# EAGLE design PowerSupply_12V_v1 (EAGLE 9.6.2)

## Sheet 1 of 3: MAIN
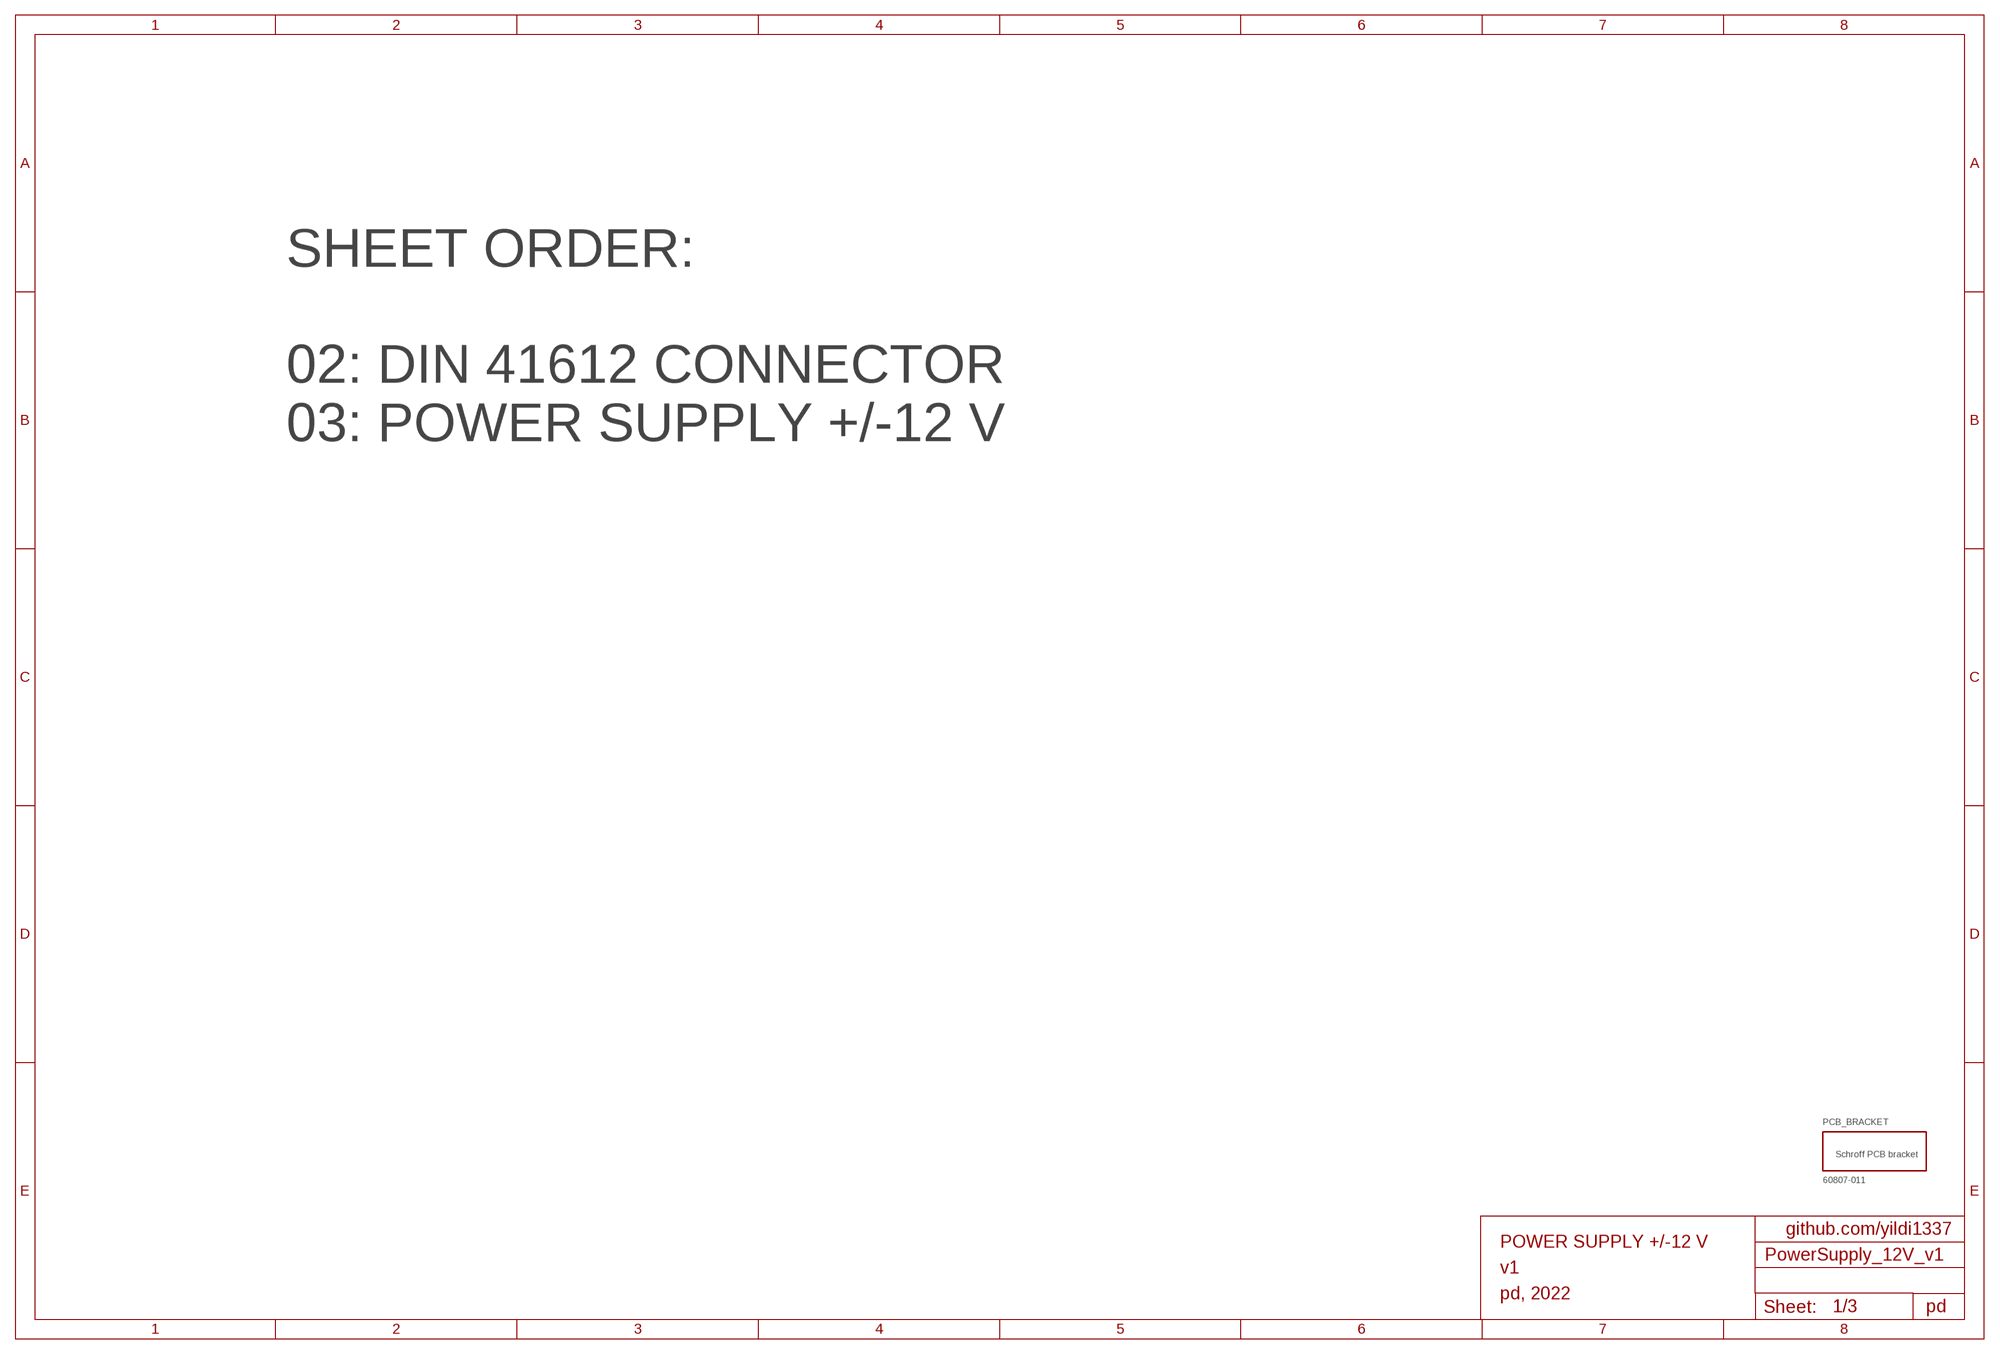
[diagram p0: schematic, sheet 1]

### Parts
PCB_BRACKET  60807-011  [60807-011]

### Notes on the sheet
- SHEET ORDER:
  
  02: DIN 41612 CONNECTOR
  03: POWER SUPPLY +/-12 V
- github.com/yildi1337
- POWER SUPPLY +/-12 V
- v1
- pd, 2022
- pd

## Sheet 2 of 3: DIN 41612 CONNECTOR
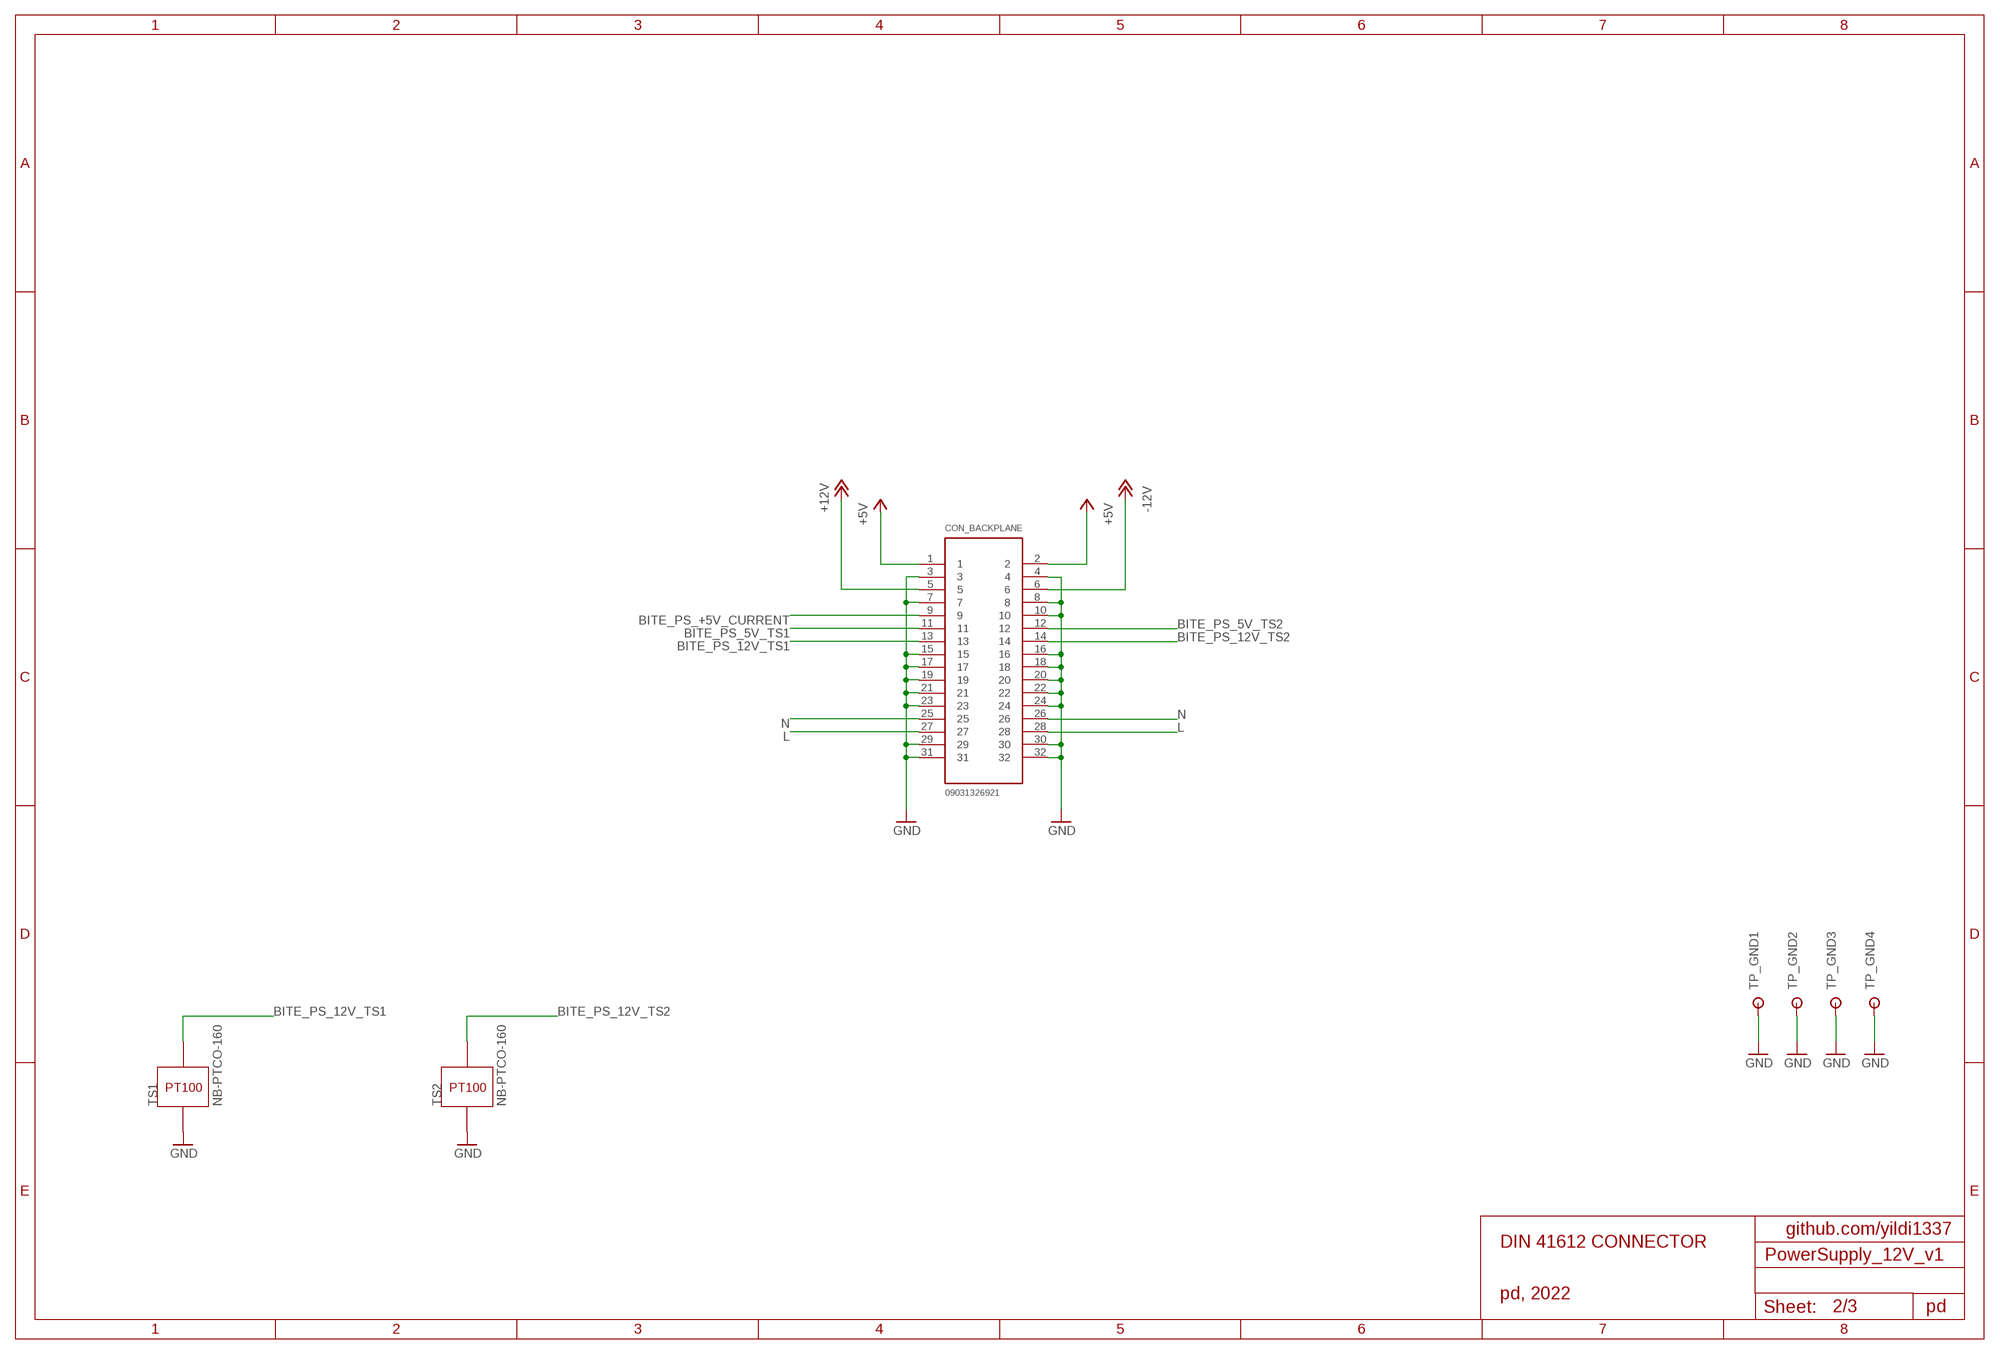
[diagram p1: schematic, sheet 2]

### Parts
CON_BACKPLANE  09031326921  [09031326921]
TP_GND1  RSPRO-1MM-TERMINAL-POST-2622034  [RSPRO-1MM-TERMINAL-POST-2622034]
TP_GND2  RSPRO-1MM-TERMINAL-POST-2622034  [RSPRO-1MM-TERMINAL-POST-2622034]
TP_GND3  RSPRO-1MM-TERMINAL-POST-2622034  [RSPRO-1MM-TERMINAL-POST-2622034]
TP_GND4  RSPRO-1MM-TERMINAL-POST-2622034  [RSPRO-1MM-TERMINAL-POST-2622034]
TS1  NB-PTCO-160  [NB-PTCO-160]
TS2  NB-PTCO-160  [NB-PTCO-160]

### Nets
+5V: CON_BACKPLANE.1 CON_BACKPLANE.2
+12V: CON_BACKPLANE.5 ; also sheet 3
-12V: CON_BACKPLANE.6 ; also sheet 3
BITE_PS_5V_TS1: CON_BACKPLANE.11
BITE_PS_5V_TS2: CON_BACKPLANE.12
BITE_PS_12V_TS1: CON_BACKPLANE.13 TS1.1
BITE_PS_12V_TS2: CON_BACKPLANE.14 TS2.1
BITE_PS_+5V_CURRENT: CON_BACKPLANE.9
GND: CON_BACKPLANE.3 CON_BACKPLANE.4 CON_BACKPLANE.7 CON_BACKPLANE.8 CON_BACKPLANE.10 CON_BACKPLANE.15 CON_BACKPLANE.16 CON_BACKPLANE.17 CON_BACKPLANE.18 CON_BACKPLANE.19 CON_BACKPLANE.20 CON_BACKPLANE.21 CON_BACKPLANE.22 CON_BACKPLANE.23 CON_BACKPLANE.24 CON_BACKPLANE.29 CON_BACKPLANE.30 CON_BACKPLANE.31 CON_BACKPLANE.32 TP_GND1.P$1 TP_GND2.P$1 TP_GND3.P$1 TP_GND4.P$1 TS1.2 TS2.2 ; also sheet 3
L: CON_BACKPLANE.27 CON_BACKPLANE.28 ; also sheet 3
N: CON_BACKPLANE.25 CON_BACKPLANE.26 ; also sheet 3

### Notes on the sheet
- github.com/yildi1337
- DIN 41612 CONNECTOR
- pd, 2022
- pd

## Sheet 3 of 3: POWER SUPPLY +/-12 V
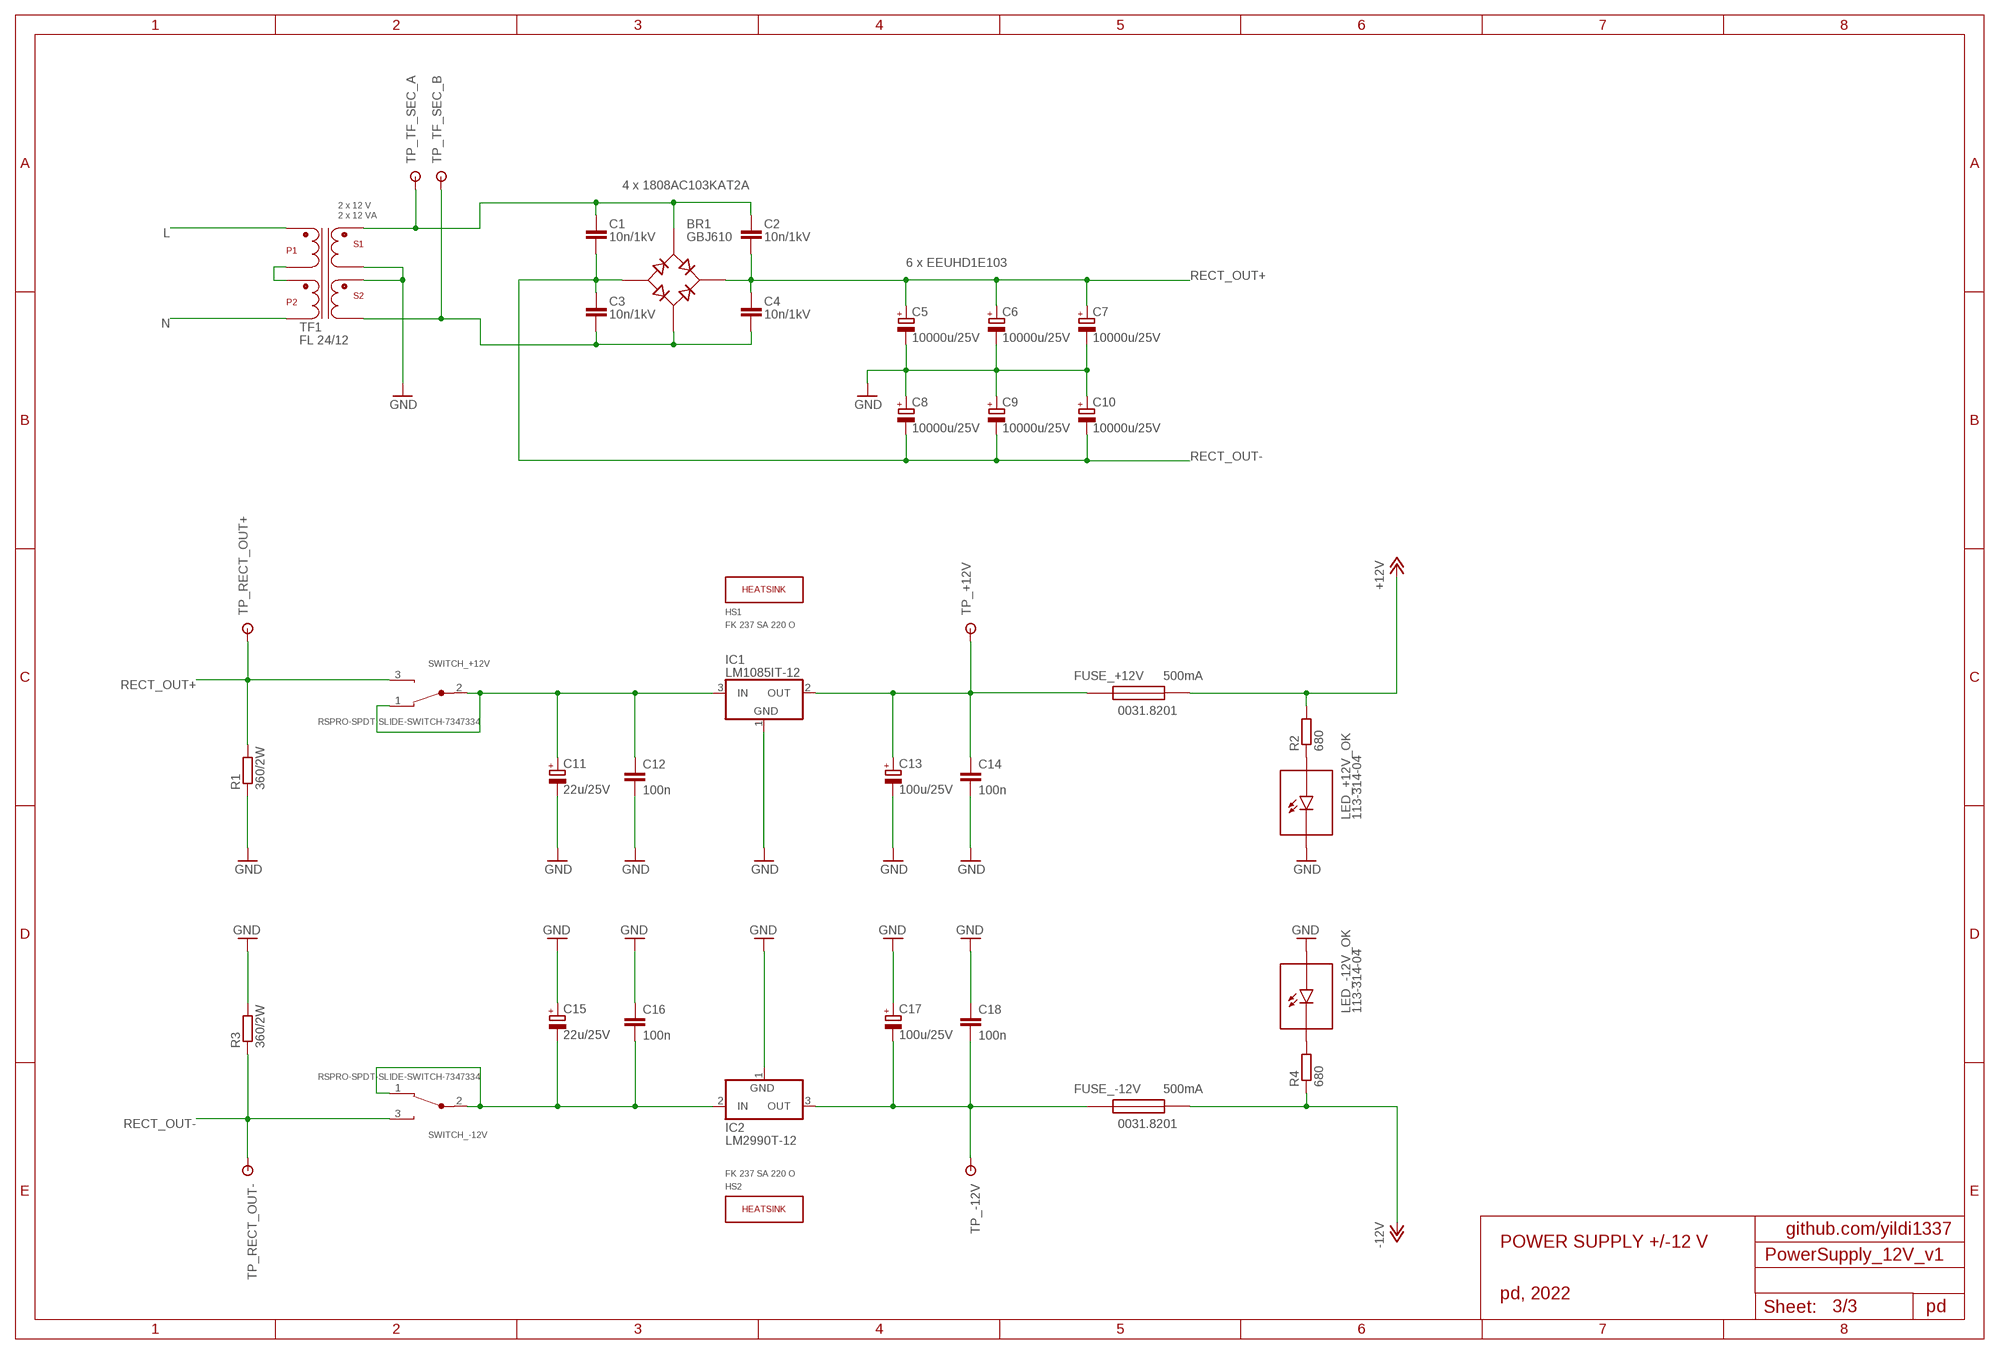
[diagram p2: schematic, sheet 3]

### Parts
BR1  GBJ610  [GBJ610]
C1  10n/1kV  C-EUC1808  [C1808]
C2  10n/1kV  C-EUC1808  [C1808]
C3  10n/1kV  C-EUC1808  [C1808]
C4  10n/1kV  C-EUC1808  [C1808]
C5  10000u/25V  EEUHD1E103  [EEUHD1E103]
C6  10000u/25V  EEUHD1E103  [EEUHD1E103]
C7  10000u/25V  EEUHD1E103  [EEUHD1E103]
C8  10000u/25V  EEUHD1E103  [EEUHD1E103]
C9  10000u/25V  EEUHD1E103  [EEUHD1E103]
C10  10000u/25V  EEUHD1E103  [EEUHD1E103]
C11  22u/25V  CPOL-EU153CLV-0505  [153CLV-0505]
C12  100n  C-EUC0603  [C0603]
C13  100u/25V  CPOL-EU153CLV-0810  [153CLV-0810]
C14  100n  C-EUC0603  [C0603]
C15  22u/25V  CPOL-EU153CLV-0505  [153CLV-0505]
C16  100n  C-EUC0603  [C0603]
C17  100u/25V  CPOL-EU153CLV-0810  [153CLV-0810]
C18  100n  C-EUC0603  [C0603]
FUSE_+12V  0031.8201  [0031.8201]
FUSE_-12V  0031.8201  [0031.8201]
HS1  FK 237 SA 220 O  FK_237_SA_220_O  [FK_237_SA_220_O]
HS2  FK 237 SA 220 O  FK_237_SA_220_O  [FK_237_SA_220_O]
IC1  LM1085IT-12  [LM1085IT-12]
IC2  LM2990T-12  [LM2990T-12]
LED_+12V_OK  113-314-04  [113-314-04]
LED_-12V_OK  113-314-04  [113-314-04]
R1  360/2W  R-EU_R2010  [R2010]
R2  680  R-EU_R0603  [R0603]
R3  360/2W  R-EU_R2010  [R2010]
R4  680  R-EU_R0603  [R0603]
SWITCH_+12V  RSPRO-SPDT-SLIDE-SWITCH-7347334  [RSPRO-SPDT-SLIDE-SWITCH-7347334]
SWITCH_-12V  RSPRO-SPDT-SLIDE-SWITCH-7347334  [RSPRO-SPDT-SLIDE-SWITCH-7347334]
TF1  FL 24/12  FL_24-12  [FL_24-12]
TP_+12V  RSPRO-1MM-TERMINAL-POST-2622034  [RSPRO-1MM-TERMINAL-POST-2622034]
TP_-12V  RSPRO-1MM-TERMINAL-POST-2622034  [RSPRO-1MM-TERMINAL-POST-2622034]
TP_RECT_OUT+  RSPRO-1MM-TERMINAL-POST-2622034  [RSPRO-1MM-TERMINAL-POST-2622034]
TP_RECT_OUT-  RSPRO-1MM-TERMINAL-POST-2622034  [RSPRO-1MM-TERMINAL-POST-2622034]
TP_TF_SEC_A  RSPRO-1MM-TERMINAL-POST-2622034  [RSPRO-1MM-TERMINAL-POST-2622034]
TP_TF_SEC_B  RSPRO-1MM-TERMINAL-POST-2622034  [RSPRO-1MM-TERMINAL-POST-2622034]

### Nets
+12V: FUSE_+12V.2 R2.2 ; also sheet 2
-12V: FUSE_-12V.2 R4.1 ; also sheet 2
GND: C5.- C6.- C7.- C8.+ C9.+ C10.+ C11.- C12.2 C13.- C14.2 C15.+ C16.1 C17.+ C18.1 IC1.1(GND) IC2.1(GND) LED_+12V_OK.-(C) LED_-12V_OK.+(A) R1.1 R3.2 TF1.S1B TF1.S2A ; also sheet 2
L: TF1.P1A ; also sheet 2
N: TF1.P2B ; also sheet 2
N$1: C15.- C16.2 IC2.2(IN) SWITCH_-12V.1(NC) SWITCH_-12V.2(COM)
N$2: LED_-12V_OK.-(C) R4.2
N$3: C17.- C18.2 FUSE_-12V.1 IC2.3(OUT) TP_-12V.P$1
N$5: TF1.P1B TF1.P2A
N$6: BR1.L C1.1 C2.1 TF1.S1A TP_TF_SEC_A.P$1
N$7: LED_+12V_OK.+(A) R2.1
N$8: C13.+ C14.1 FUSE_+12V.1 IC1.2(OUT) TP_+12V.P$1
N$10: BR1.N C3.2 C4.2 TF1.S2B TP_TF_SEC_B.P$1
N$12: C11.+ C12.1 IC1.3(IN) SWITCH_+12V.1(NC) SWITCH_+12V.2(COM)
RECT_OUT+: BR1.+ C2.2 C4.1 C5.+ C6.+ C7.+ R1.2 SWITCH_+12V.3(NO) TP_RECT_OUT+.P$1
RECT_OUT-: BR1.- C1.2 C3.1 C8.- C9.- C10.- R3.1 SWITCH_-12V.3(NO) TP_RECT_OUT-.P$1

### Notes on the sheet
- 4 x 1808AC103KAT2A
- 6 x EEUHD1E103
- 500mA
- 500mA
- github.com/yildi1337
- POWER SUPPLY +/-12 V
- pd, 2022
- pd

## Library data of the parts
BR1 = GBJ610:GBJ610
C1-C4 C12 C14 C16 C18 = rcl:C-EU: CAPACITOR, European symbol; SPICEPREFIX: C
C5-C10 = EEUHD1E103:EEUHD1E103
C11 C13 C15 C17 = rcl:CPOL-EU: POLARIZED CAPACITOR, European symbol; SPICEPREFIX: C
CON_BACKPLANE = 09031326921:09031326921
FUSE_+12V FUSE_-12V = 0031.8201:0031.8201
HS1 HS2 = FK_237_SA_220_O:FK_237_SA_220_O
IC1 = LM1085IT-12:LM1085IT-12
IC2 = LM2990T-12:LM2990T-12
LED_+12V_OK LED_-12V_OK = 113-314-04:113-314-04
PCB_BRACKET = 60807-011:60807-011
R1-R4 = rcl:R-EU_: RESISTOR, European symbol; SPICEPREFIX: R
SWITCH_+12V SWITCH_-12V = RSPRO-SPDT-SLIDE-SWITCH-7347334:RSPRO-SPDT-SLIDE-SWITCH-7347334
TF1 = FL_24-12:FL_24-12
TP_+12V TP_-12V TP_GND1-TP_GND4 TP_RECT_OUT+ TP_RECT_OUT- TP_TF_SEC_A TP_TF_SEC_B = RSPRO-1MM-TERMINAL-POST-2622034:RSPRO-1MM-TERMINAL-POST-2622034
TS1 TS2 = NB-PTCO-160:NB-PTCO-160

## Board
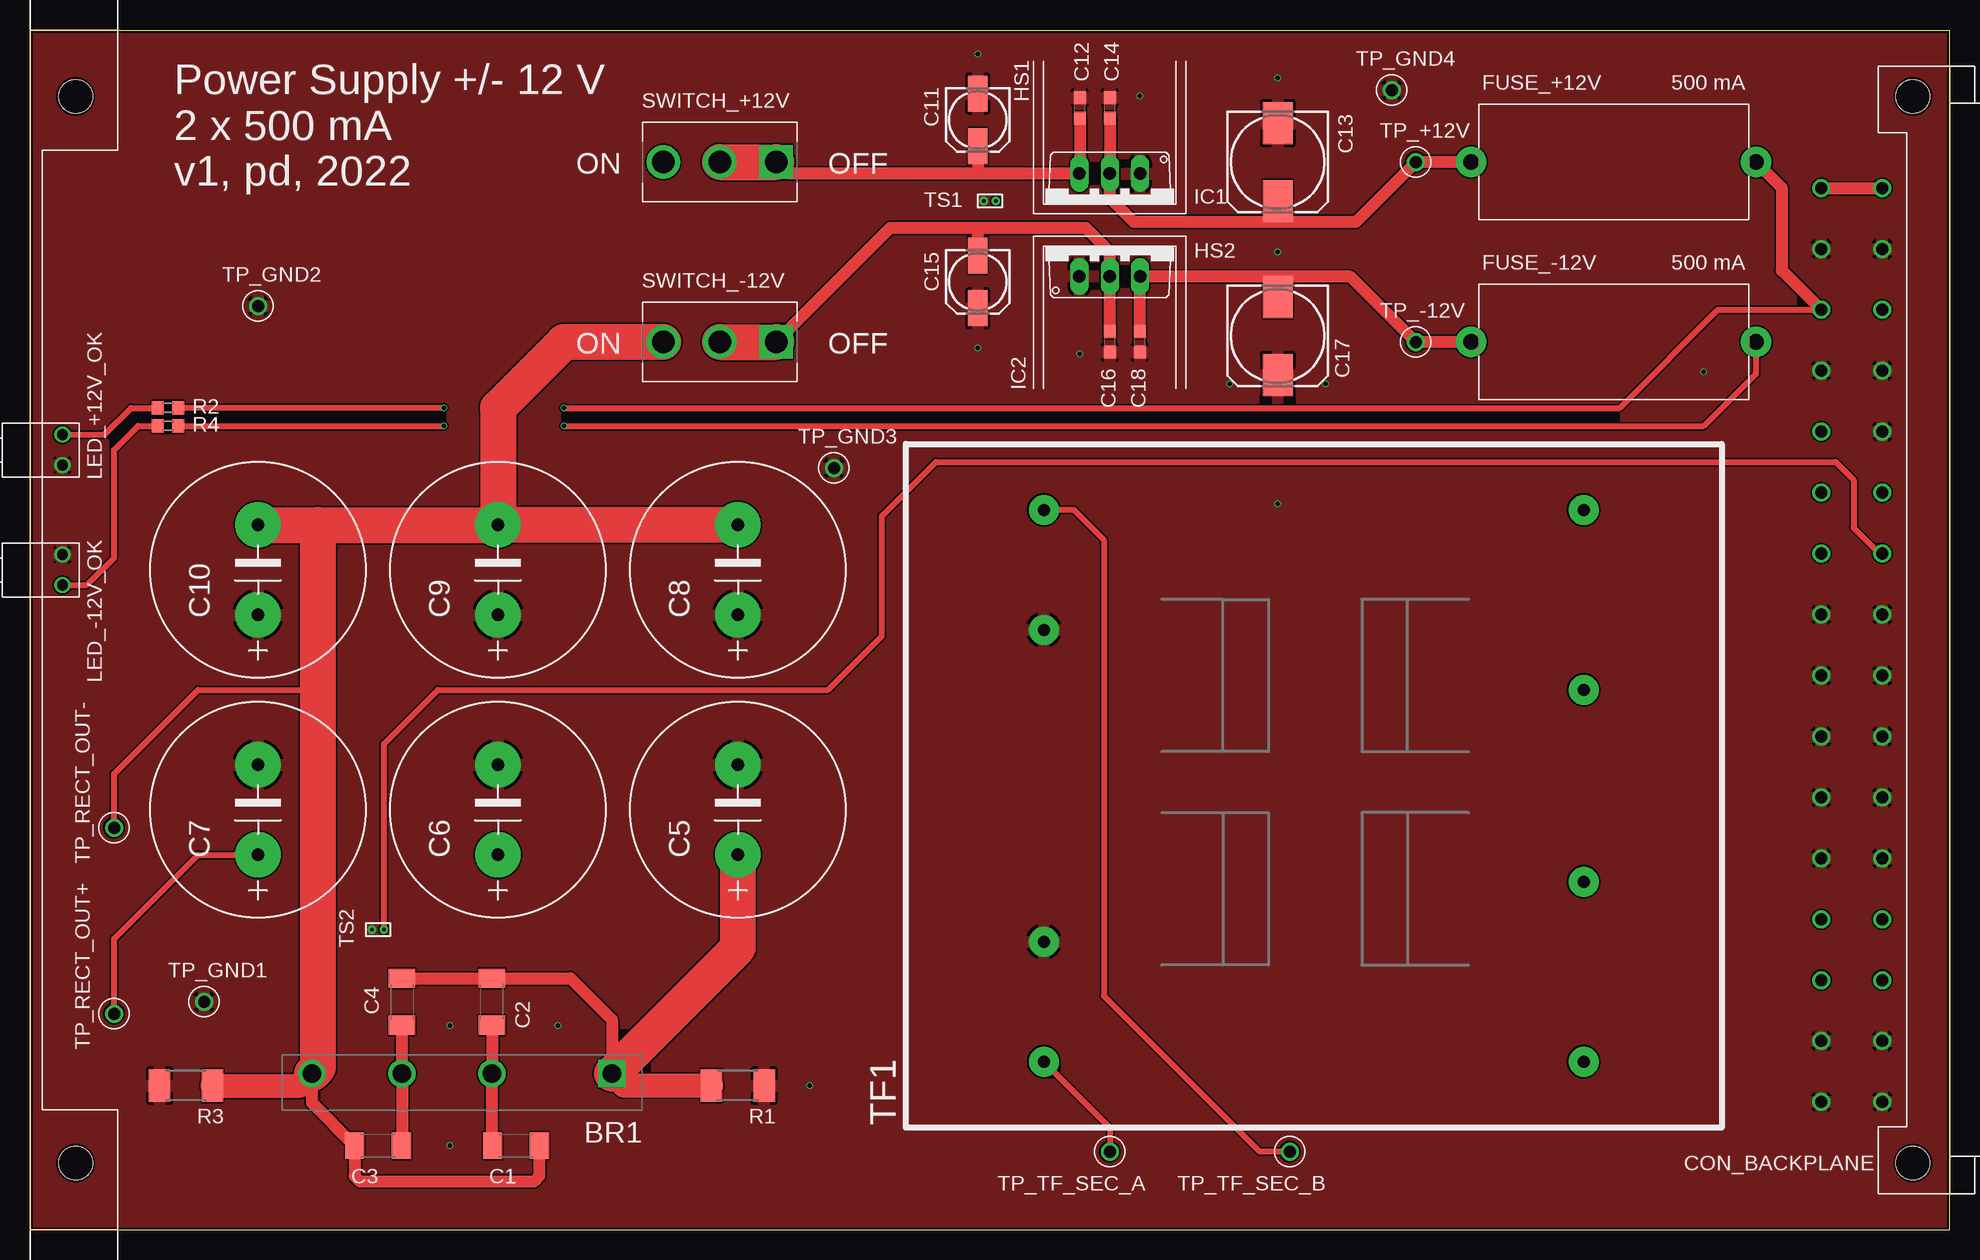
[diagram p3: board, top side]
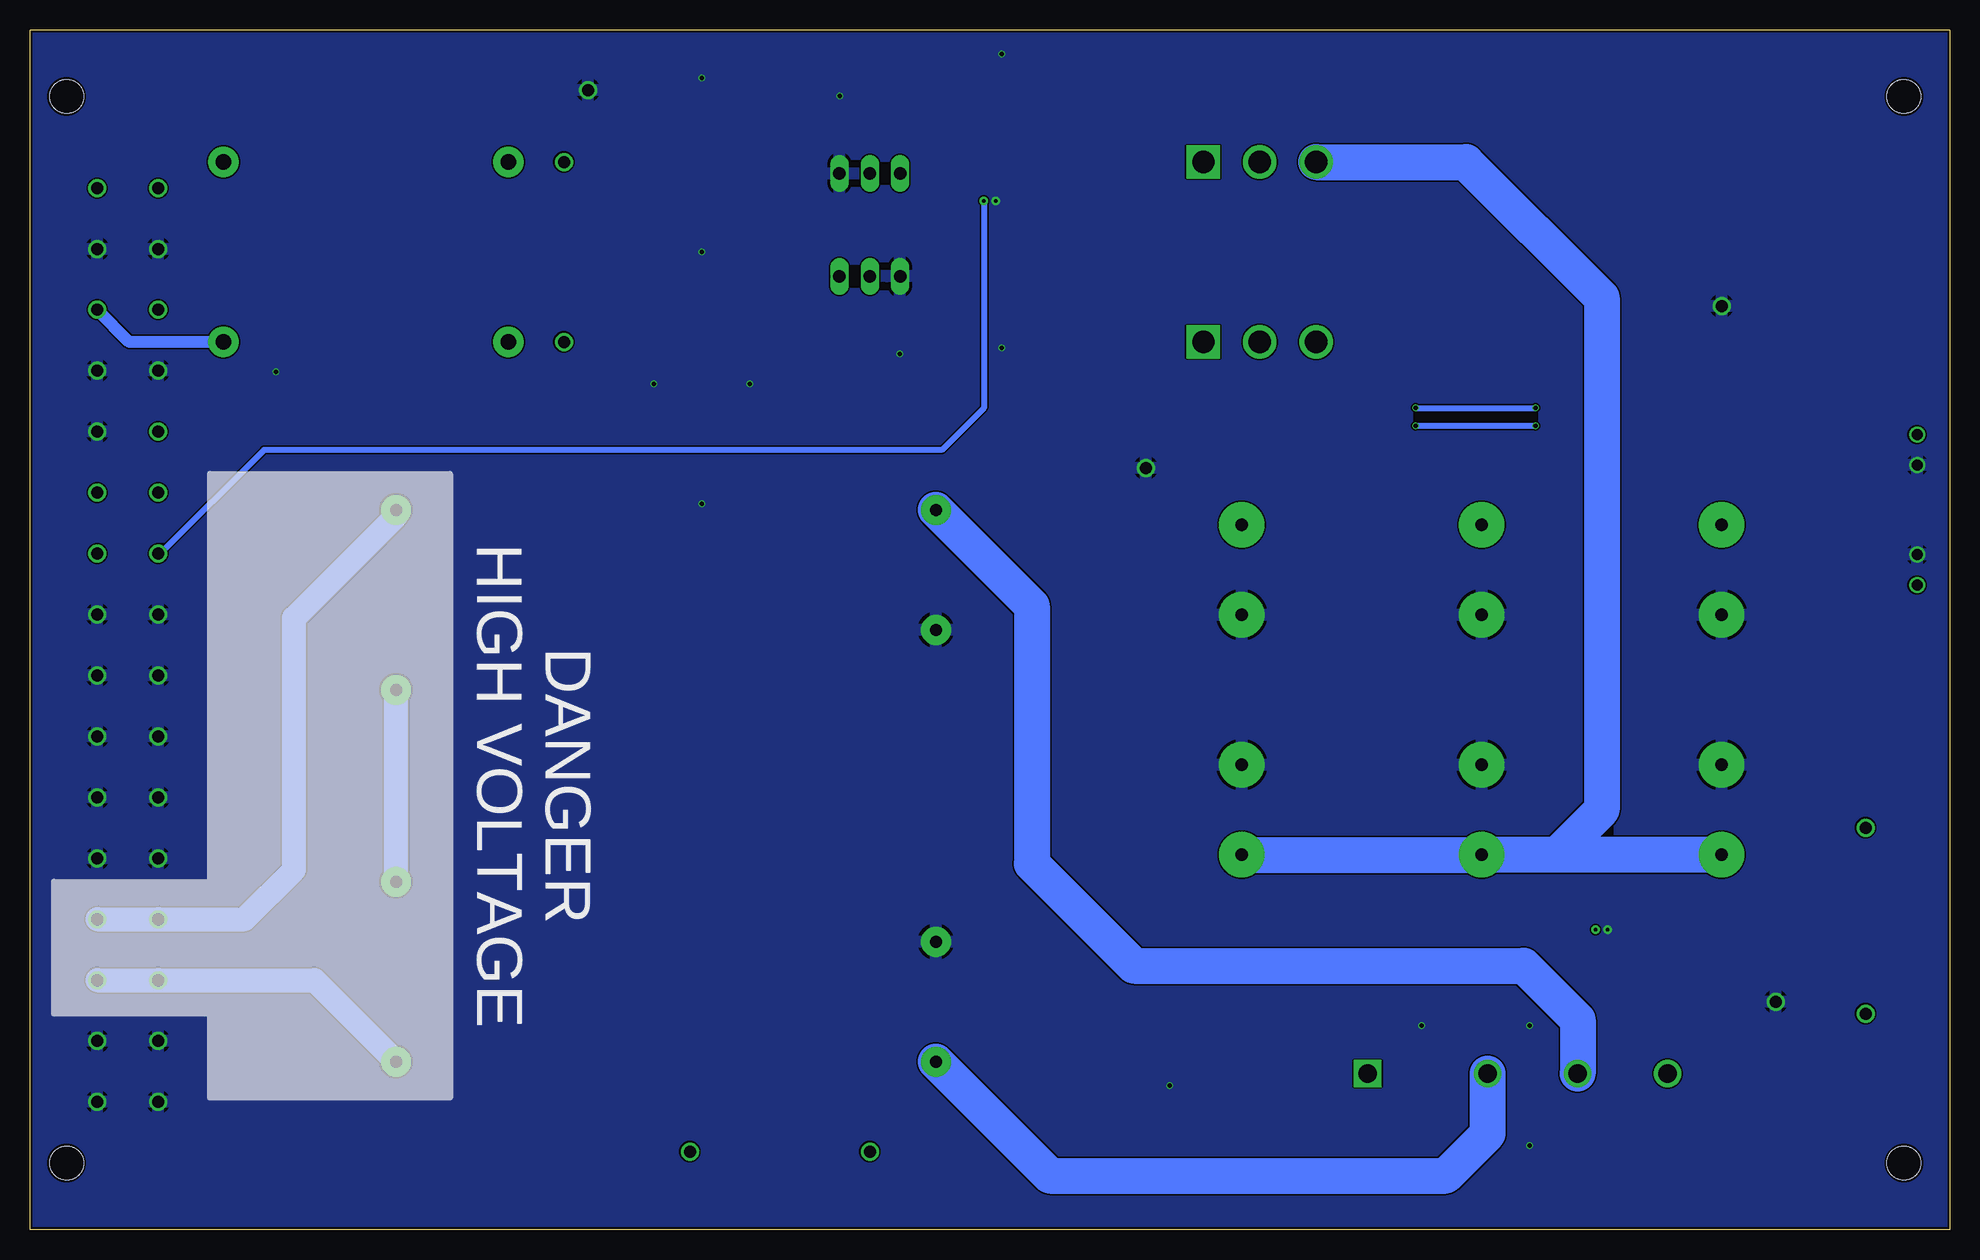
[diagram p4: board, bottom side, seen from below]

Size 160 x 100 mm. Coordinates in mm from the lower left corner, seen from the top.
Outline: 0,0 160,0 160,100 0,100 0,0
Copper layers (1*16): Top 0.035559375mm / dielectric 1.6mm / Bottom 0.035559375mm
Design rules "jlcpcb2layer": minimum track width 5mil, minimum drill 12mil, track to track 5mil, track to pad 5mil, pad to pad 5mil, via to via 5mil, smd to smd 5mil, copper to edge 8mil, drill to drill 6mil, minimum pad ring 5mil, minimum via ring 3mil, stop-mask expansion 2.5mil, vias tented up to drill 0mil, thermal gap 10mil

### Footprints (pad centres in the part's own frame; a part is rotated, then mirrored left to right if it is on the bottom)
GBJ610 = drill 1.51 pad 2.27 square: + -12.5,0 | drill 1.51 pad 2.27: - 12.5,0; L -2.5,0; N 5,0
C1808 = smd 1.6 x 2.2: 1 -1.95,0; 2 1.95,0
EEUHD1E103 = drill 1.016 pad 3.81: + -3.75,0; - 3.75,0
153CLV-0505 = smd 3 x 1.6: + 2.2,0; - -2.2,0
C0603 = smd 1.1 x 1: 1 -0.85,0; 2 0.85,0
153CLV-0810 = smd 3.5 x 2.5: + 3.25,0; - -3.25,0
09031326921 = drill 1: 1 36.83,10.7; 2 36.83,5.62; 3 31.75,10.7; 4 31.75,5.62; 5 26.67,10.7; 6 26.67,5.62; 7 21.59,10.7; 8 21.59,5.62; 9 16.51,10.7; 10 16.51,5.62; 11 11.43,10.7; 12 11.43,5.62; 13 6.35,10.7; 14 6.35,5.62; 15 1.27,10.7; 16 1.27,5.62; 17 -3.81,10.7; 18 -3.81,5.62; 19 -8.89,10.7; 20 -8.89,5.62; 21 -13.97,10.7; 22 -13.97,5.62; 23 -19.05,10.7; 24 -19.05,5.62; 25 -24.13,10.7; 26 -24.13,5.62; 27 -29.21,10.7; 28 -29.21,5.62; 29 -34.29,10.7; 30 -34.29,5.62; 31 -39.37,10.7; 32 -39.37,5.62 | hole 2.8: -44.45,3.05; 44.45,3.05
0031.8201 = drill 1.3 pad 2.54: 1 -11.875,0; 2 11.875,0
LM1085IT-12 = drill 1.016 long: 1 -2.54,-2.54; 2 0,-2.54; 3 2.54,-2.54
LM2990T-12 = drill 1.016 long: 1 -2.54,-2.54; 2 0,-2.54; 3 2.54,-2.54
113-314-04 = drill 0.9: + -1.27,0; - 1.27,0
60807-011 = hole 2.8: 0,44.45; 0,-44.45
R2010 = smd 1.8 x 2.7: 1 -2.2,0; 2 2.2,0
R0603 = smd 1 x 1.1: 1 -0.85,0; 2 0.85,0
RSPRO-SPDT-SLIDE-SWITCH-7347334 = drill 1.85 square: 1 -4.7,0 | drill 1.85: 2 0,0; 3 4.7,0
FL_24-12 = drill 1 pad 2.5: P1A -22.5,23; P1B -22.5,8; P2A -22.5,-8; P2B -22.5,-23; S1A 22.5,23; S1B 22.5,13; S2A 22.5,-13; S2B 22.5,-23
RSPRO-1MM-TERMINAL-POST-2622034 = drill 1: P$1 0,0
NB-PTCO-160 = drill 0.275 pad 0.711: 1 -0.5,0; 2 0.5,0

### Placement (x,y rotation side)
BR1  36,13 180 top
C1  40.5,7 0 top
C2  38.5,19 90 top
C3  29,7 0 top
C4  31,19 270 top
C5  59,35 90 top
C6  39,35 90 top
C7  19,35 90 top
C8  59,55 90 top
C9  39,55 90 top
C10  19,55 90 top
C11  79,92.5 270 top
C12  87.5,93.5 90 top
C13  104,89 270 top
C14  90,93.5 90 top
C15  79,79 270 top
C16  90,74 90 top
C17  104,74.5 270 top
C18  92.5,74 90 top
CON_BACKPLANE  160,50 90 top
FUSE_+12V  132,89 0 top
FUSE_-12V  132,74 0 top
HS1  90,85.5 180 top
HS2  90,82 0 top
IC1  90,85.5 180 top
IC2  90,82 0 top
LED_+12V_OK  2.7,65 270 top
LED_-12V_OK  2.7,55 270 top
PCB_BRACKET  3.8,50 0 top
R1  59,12 180 top
R2  11.5,68.5 0 top
R3  13,12 180 top
R4  11.5,67 180 top
SWITCH_+12V  57.5,89 180 top
SWITCH_-12V  57.5,74 180 top
TF1  107,37 180 top
TP_+12V  115.5,89 0 top
TP_-12V  115.5,74 0 top
TP_GND1  14.5,19 0 top
TP_GND2  19,77 0 top
TP_GND3  67,63.5 0 top
TP_GND4  113.5,95 0 top
TP_RECT_OUT+  7,18 90 top
TP_RECT_OUT-  7,33.5 90 top
TP_TF_SEC_A  90,6.5 180 top
TP_TF_SEC_B  105,6.5 180 top
TS1  80,85.75 180 top
TS2  29,25 180 top

### Tracks (layer width: path | path; a pad name or v marks a point on that pad's centre or on a via)
+5V
  Top 1: CON_BACKPLANE.1 CON_BACKPLANE.2
+12V  (via drill 0.35)
  Top 0.5: v34.5,68.5 R2.2 | v44.5,68.5 132.5,68.5 140.67,76.67 CON_BACKPLANE.5
  Top 1: FUSE_+12V.2 146,86.88 146,79.97 CON_BACKPLANE.5
  Bottom 0.5: v44.5,68.5 v34.5,68.5
-12V  (via drill 0.35)
  Top 0.5: R4.1 v34.5,67 | v44.5,67 139.5,67 143.88,71.38 FUSE_-12V.2
  Bottom 0.5: v34.5,67 v44.5,67
  Bottom 1: FUSE_-12V.2 151.71,74 CON_BACKPLANE.6
BITE_PS_12V_TS1
  Bottom 0.5: TS1.1 80.5,68.5 84,65 140.5,65 149.15,56.35 CON_BACKPLANE.13
BITE_PS_12V_TS2
  Top 0.5: TS2.1 29.5,40.5 34,45 66.5,45 71,49.5 71,59.5 75.5,64 150.5,64 152,62.5 152,58.5 154.15,56.35 CON_BACKPLANE.14
GND  (via drill 0.35)
  other vias: 79,98 79,73.5 35,17 35,7 44,17 65,12 92.5,94.5 108,70.5 104,60.5 87.5,73 104,81.5 104,96 100,70.5 139.5,71.5
  pour Bottom: 0,0 0,100 160,100 160,0
  pour Top: 0,0 0,100 160,100 160,0
L
  Bottom 2: CON_BACKPLANE.28 CON_BACKPLANE.27 136.29,20.79 TF1.P1A
N
  Bottom 2: CON_BACKPLANE.26 CON_BACKPLANE.25 142.13,25.87 138,30 138,51 129.5,59.5 TF1.P2B
N$1
  Top 1: C16.2 IC2.2 90,81.5 88,83.5 79,83.5 | 79,83.5 71.7,83.5 SWITCH_-12V.1 | C15.- 79,83.5
  Top 3: SWITCH_-12V.2 SWITCH_-12V.1
N$2
  Top 0.5: LED_-12V_OK.- 4.73,53.73 7,56 7,65 9,67 R4.2
N$3
  Top 1: C18.2 92.5,79.42 | 92.5,79.42 IC2.3 | FUSE_-12V.1 TP_-12V.P$1 110.08,79.42 104,79.42 | 104,79.42 92.5,79.42 | C17.- 104,79.42
N$5
  Bottom 2: TF1.P1B TF1.P2A
N$6
  Top 0.5: TF1.S1A 90,8.5 TP_TF_SEC_A.P$1
  Top 1: C1.1 38.5,7.05 BR1.L C2.1
  Bottom 3: TF1.S1A 75,4.5 42,4.5 38.5,8 BR1.L
N$7
  Top 0.5: LED_+12V_OK.+ 6.2,66.27 8.43,68.5 R2.1
N$8
  Top 1: C14.1 IC1.2 90,86 92,84 104,84 | FUSE_+12V.1 TP_+12V.P$1 110.5,84 104,84 | C13.+ 104,84
N$10
  Top 0.5: TP_TF_SEC_B.P$1 102.5,6.5 89.5,19.5 89.5,57.5 87,60 TF1.S2B
  Top 1: C3.2 31,7.05 BR1.N C4.2
  Bottom 3: TF1.S2B 76.5,52 76.5,30.5 68,22 35.5,22 31,17.5 BR1.N
N$12
  Top 1: C12.1 87.5,88.08 IC1.3 79,88.04 | 79,88.04 63.16,88.04 SWITCH_+12V.1 | C11.+ 79,88.04
  Top 3: SWITCH_+12V.2 SWITCH_+12V.1
RECT_OUT+
  Top 0.5: TP_RECT_OUT+.P$1 7,24.25 14,31.25 C7.+
  Top 1: C4.1 C2.2 45.05,20.95 48.5,17.5 BR1.+
  Top 2: R1.2 49.5,12 BR1.+
  Top 3: BR1.+ 59,23.5 C5.+
  Bottom 3: SWITCH_+12V.3 40.3,89 29,77.7 29,35 32.75,31.25 C6.+ | C5.+ C6.+ | C7.+ C6.+
RECT_OUT-
  Top 0.5: TP_RECT_OUT-.P$1 7,38 14,45 24,45
  Top 1: BR1.- 23.5,10.55 C3.1 27.05,4.45 27.5,4 42,4 42.45,4.45 C1.2
  Top 2: R3.1 22.5,12 BR1.-
  Top 3: SWITCH_-12V.3 44.5,74 39,68.5 C9.- | C8.- C9.- | C10.- 24,58.75 | 24,58.75 C9.- | BR1.- 24,13.5 24,45 24,58.75

### Text on the board
tPlace: 500 mA | Power Supply +/- 12 V / 2 x 500 mA / v1, pd, 2022 | 500 mA
bPlace: DANGER / HIGH VOLTAGE
tNames: ON | OFF | ON | OFF